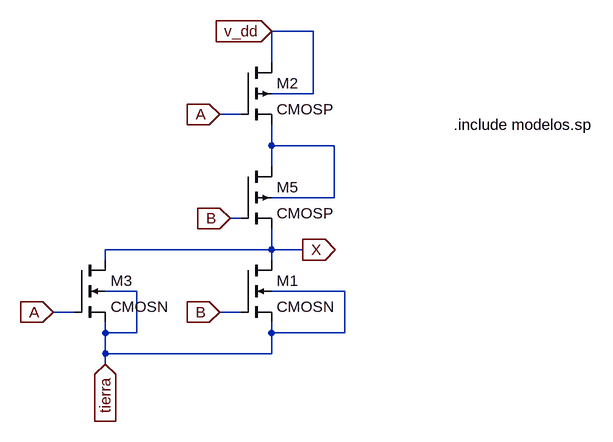
[diagram p0: schematic Instancia_NOR_2mA.asc]
Instancia_NOR_2mA.asc, the LTspice schematic file:
Version 4
SHEET 1 1484 824
WIRE 224 -256 160 -256
WIRE 160 -208 160 -256
WIRE 224 -160 224 -256
WIRE 224 -160 160 -160
WIRE 112 -128 80 -128
WIRE 160 -80 160 -112
WIRE 256 -80 160 -80
WIRE 160 -48 160 -80
WIRE 256 0 256 -80
WIRE 256 0 160 0
WIRE 112 32 96 32
WIRE 160 80 160 48
WIRE 160 80 -96 80
WIRE 208 80 160 80
WIRE -96 96 -96 80
WIRE 160 96 160 80
WIRE -48 144 -96 144
WIRE 272 144 160 144
WIRE -144 176 -176 176
WIRE 112 176 80 176
WIRE -96 208 -96 192
WIRE -48 208 -48 144
WIRE -48 208 -96 208
WIRE 160 208 160 192
WIRE 272 208 272 144
WIRE 272 208 160 208
WIRE -96 240 -96 208
WIRE 160 240 160 208
WIRE 160 240 -96 240
WIRE -96 256 -96 240
FLAG 160 -256 v_dd
IOPIN 160 -256 In
FLAG 80 -128 A
IOPIN 80 -128 In
FLAG -176 176 A
IOPIN -176 176 In
FLAG 80 176 B
IOPIN 80 176 In
FLAG -96 256 tierra
IOPIN -96 256 In
FLAG 96 32 B
IOPIN 96 32 In
FLAG 208 80 X
IOPIN 208 80 Out
SYMBOL nmos4 112 96 R0
SYMATTR InstName M1
SYMATTR Value CMOSN
SYMATTR Value2 l=0.6u w=7.5u
SYMBOL pmos4 112 -208 R0
SYMATTR InstName M2
SYMATTR Value CMOSP
SYMATTR Value2 l=.6u w=26.1u
SYMBOL nmos4 -144 96 R0
SYMATTR InstName M3
SYMATTR Value CMOSN
SYMATTR Value2 l=0.6u w=7.5u
SYMBOL pmos4 112 -48 R0
SYMATTR InstName M5
SYMATTR Value CMOSP
SYMATTR Value2 l=.6u w=26.1u
TEXT 440 -112 Left 2 !.include modelos.sp

The netlist it stands for:
* Instancia_NOR_2mA.asc
M1 X B tierra tierra CMOSN l=0.6u w=7.5u
M2 v_dd A N001 v_dd CMOSP l=.6u w=26.1u
M3 X A tierra tierra CMOSN l=0.6u w=7.5u
M5 N001 B X N001 CMOSP l=.6u w=26.1u
.model NMOS NMOS
.model PMOS PMOS
.lib standard.mos
.include modelos.sp
.backanno
.end